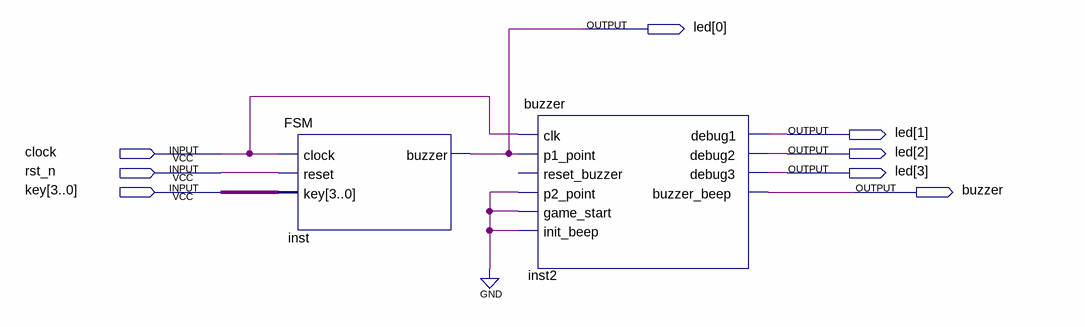
[diagram p0: schematic sheet]
// Quartus schematic teste_FSM.bdf as structural Verilog: 2 symbols, 8 pins
module teste_FSM (
  input  clock,
  input  rst_n,
  input  [3:0] key,
  output [3:0] led,
  output buzzer
);

  FSM inst (.clock(clock), .reset(rst_n), .key(key), .buzzer(led[0]));
  buzzer inst2 (
    .clk(clock), .p1_point(led[0]), .p2_point(1'b0), .game_start(1'b0), .init_beep(1'b0), .debug1(led[1]),
    .debug2(led[2]), .debug3(led[3]), .buzzer_beep(buzzer));  // open: reset_buzzer
endmodule
